# Altium schematic sheet IPH11VIBRATOR.SchDoc
size A
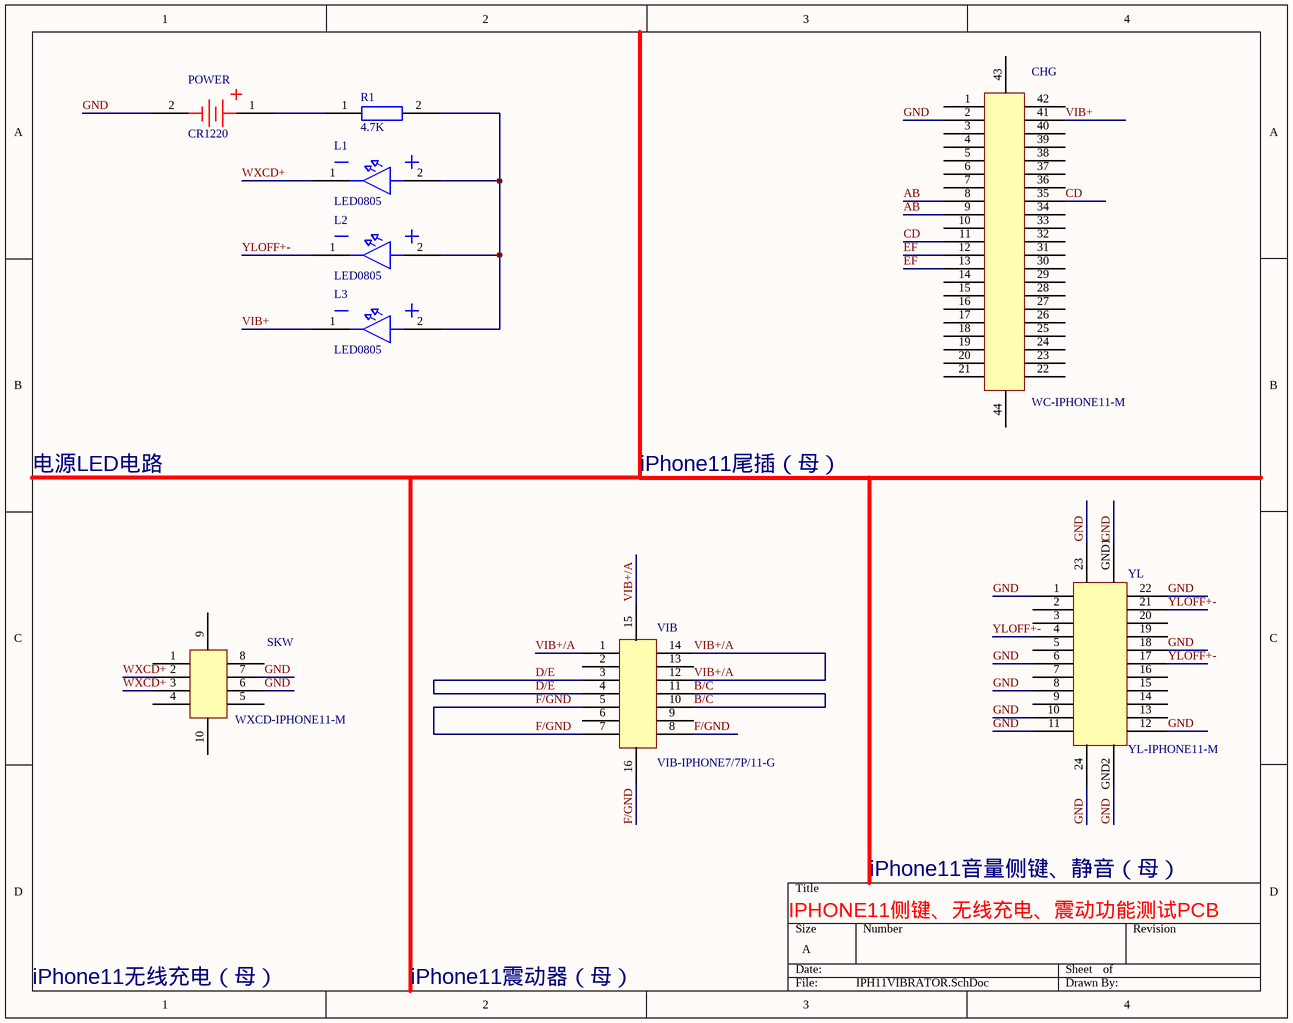
[diagram p0: IPH11VIBRATOR.SchDoc]

## Parts
CHG  WC-IPHONE11-M  [IPHONE11-WC-M]
L1  LED0805  [LED0805]
L2  LED0805  [LED0805]
L3  LED0805  [LED0805]
POWER  CR1220  [CR1220]
R1  4.7K  [R0805]
SKW  WXCD-IPHONE11-M  [IPHONE11-WXCD-M]
VIB  VIB-IPHONE7/7P/11-G  [IPHONE7/7P/11-VIB-G]
YL  YL-IPHONE11-M  [IPHONE11-YL-M]

## Nets
AB: CHG.8 CHG.9
B/C: VIB.10 VIB.11
CD: CHG.11 CHG.35
D/E: VIB.3 VIB.4
EF: CHG.12 CHG.13
F/GND: VIB.5 VIB.7 VIB.8 VIB.16
GND: CHG.2 POWER.2 SKW.6 SKW.7 YL.1 YL.6 YL.8 YL.10 YL.11 YL.12 YL.18 YL.22 YL.23 YL.24 YL.GND1 YL.GND2
VIB+: CHG.41 L3.1
VIB+/A: VIB.1 VIB.12 VIB.14 VIB.15
WXCD+: L1.1 SKW.2 SKW.3
YLOFF+-: L2.1 YL.4 YL.17 YL.21
NetL1_2: L1.2 L2.2 L3.2 R1.2
NetPOWER_1: POWER.1 R1.1

Not connected (* = marked no-connect by the designer): CHG 1 3 4 5 6 7 10 14 15 16 17 18 19 20 21 22 23 24 25 26 27 28 29 30 31 32 33 34 36 37 38 39 40 42 43 44; SKW 1 4 5 8 9 10; VIB 2 6 9 13; YL 2 3 5 7 9 13 14 15 16 19 20

## Notes on the sheet
- 电源LED电路
- iPhone11尾插（母）
- iPhone11音量侧键、静音（母）
- IPHONE11侧键、无线充电、震动功能测试PCB
- iPhone11无线充电（母）
- iPhone11震动器（母）

## Library data of the parts
POWER = CR2016
R1 = R0805